# Altium schematic sheet 51control.SchDoc
size A4
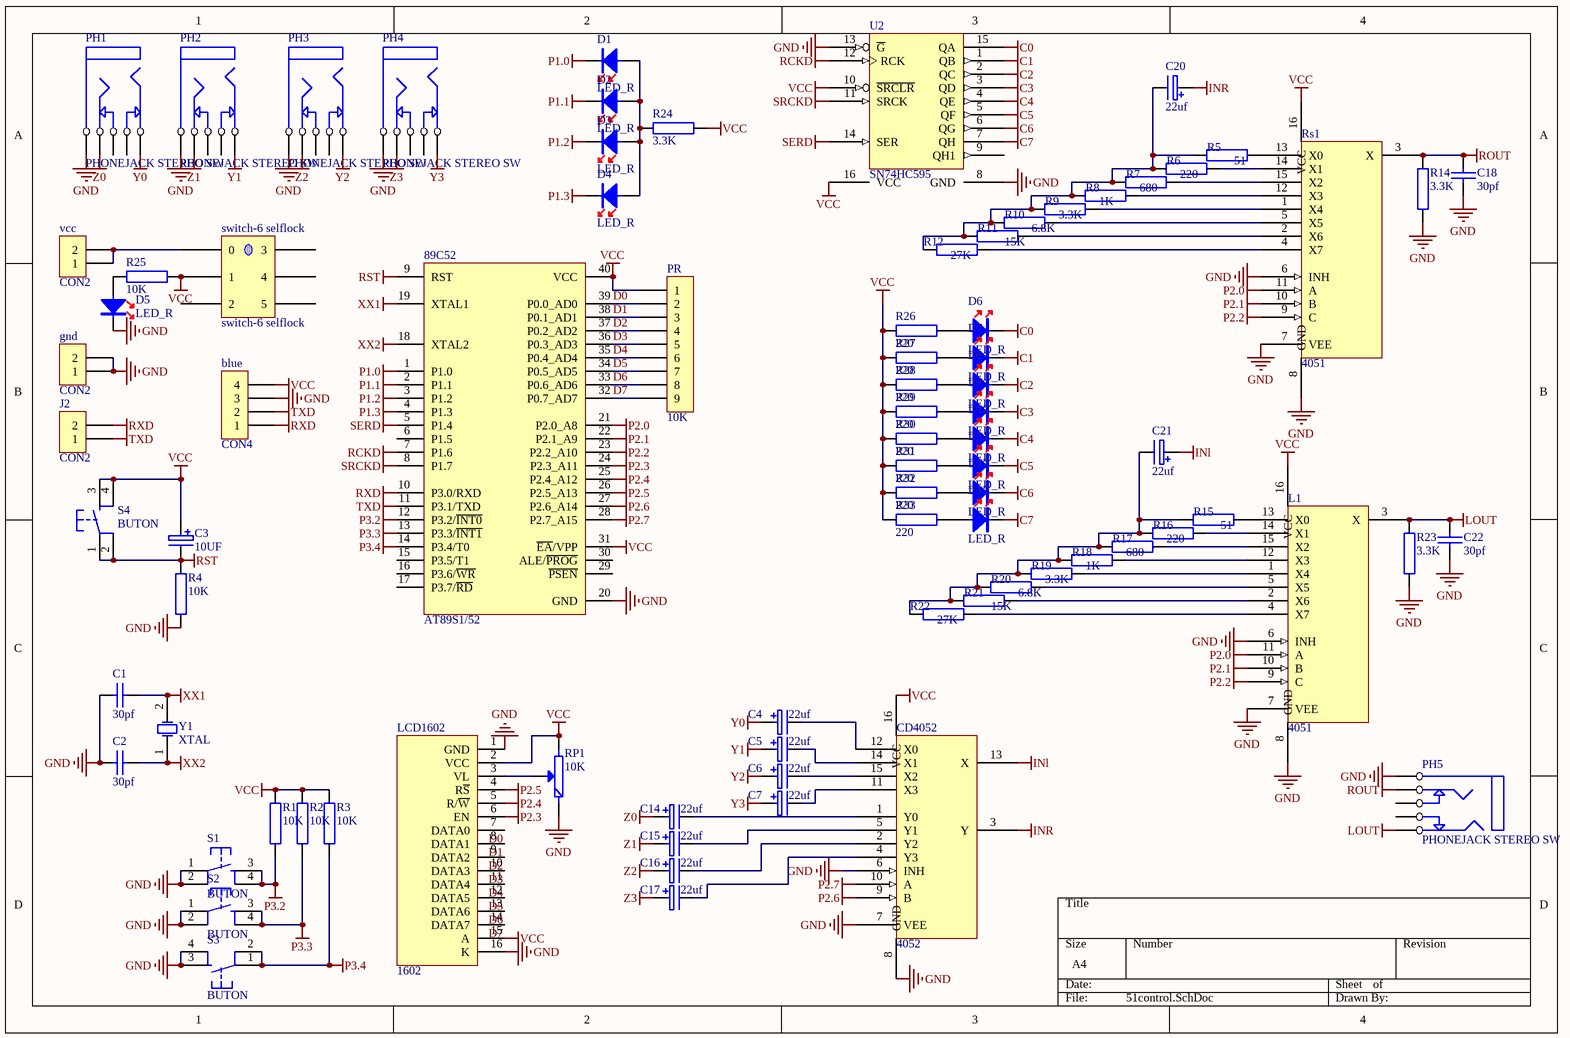
[diagram p0: 51control.SchDoc]

## Parts
89C52  AT89S1/52  [DIP40]
blue  CON4  [sip-4]
C1  30pf  [0603]
C2  30pf  [0603]
C3  10UF  [CAO2]
C4  22uf  [CAO2]
C5  22uf  [CAO2]
C6  22uf  [CAO2]
C7  22uf  [CAO2]
C14  22uf  [CAO2]
C15  22uf  [CAO2]
C16  22uf  [CAO2]
C17  22uf  [CAO2]
C18  30pf  [0603]
C20  22uf  [CAO2]
C21  22uf  [CAO2]
C22  30pf  [0603]
CD4052  4052  [CD4052]
D1  LED_R  [LED2_R]
D2  LED_R  [LED2_R]
D3  LED_R  [LED2_R]
D4  LED_R  [LED2_R]
D5  LED_R  [LED_0805]
D6  LED_R  [LED_0805]
D7  LED_R  [LED_0805]
D8  LED_R  [LED_0805]
D9  LED_R  [LED_0805]
D10  LED_R  [LED_0805]
D11  LED_R  [LED_0805]
D12  LED_R  [LED_0805]
D13  LED_R  [LED_0805]
gnd  CON2  [2P-200]
J2  CON2  [sip-2]
L1  4051  [CD4051 NSG]
LCD1602  1602  [1602A]
PH1  PHONEJACK STEREO SW  [SOUND1]
PH2  PHONEJACK STEREO SW  [SOUND1]
PH3  PHONEJACK STEREO SW  [SOUND1]
PH4  PHONEJACK STEREO SW  [SOUND1]
PH5  PHONEJACK STEREO SW  [SOUND1]
PR  10K  [sip-9]
R1  10K  [0603]
R2  10K  [0603]
R3  10K  [0603]
R4  10K  [0603]
R5  51  [0805]
R6  220  [0805]
R7  680  [0805]
R8  1K  [0805]
R9  3.3K  [0805]
R10  6.8K  [0805]
R11  15K  [0805]
R12  27K  [0805]
R14  3.3K  [0805]
R15  51  [0805]
R16  220  [0805]
R17  680  [0805]
R18  1K  [0805]
R19  3.3K  [0805]
R20  6.8K  [0805]
R21  15K  [0805]
R22  27K  [0805]
R23  3.3K  [0805]
R24  3.3K  [0805]
R25  10K  [0603]
R26  220  [0805]
R27  220  [0805]
R28  220  [0805]
R29  220  [0805]
R30  220  [0805]
R31  220  [0805]
R32  220  [0805]
R33  220  [0805]
RP1  10K  [RVR-2]
Rs1  4051  [CD4051 NSG]
S1  BUTON  [TACTILE-PTH]
S2  BUTON  [TACTILE-PTH]
S3  BUTON  [TACTILE-PTH]
S4  BUTON  [TACTILE-PTH]
switch-6_selflock  switch-6 selflock  [switch-6 lockself]
U2  SN74HC595  [SO16]
vcc  CON2  [2P-200]
Y1  XTAL  [XTAL-RAD-0.2]

## Nets
C0: D6.2 U2.15(QA)
C1: D7.2 U2.1(QB)
C2: D8.2 U2.2(QC)
C3: D9.2 U2.3(QD)
C4: D10.2 U2.4(QE)
C5: D11.2 U2.5(QF)
C6: D12.2 U2.6(QG)
C7: D13.2 U2.7(QH)
GND: 89C52.20(GND) blue.3 C1.2 C2.2 C18.2 C22.2 CD4052.6(INH) CD4052.7(VEE) CD4052.8(GND) D5.2 gnd.1 gnd.2 L1.6(INH) L1.7(VEE) L1.8(GND) LCD1602.1(GND) LCD1602.16(K) PH1.5(E) PH2.5(E) PH3.5(E) PH4.5(E) PH5.5(E) R4.2 R14.1 R23.1 RP1.1 Rs1.6(INH) Rs1.7(VEE) Rs1.8(GND) S1.1 S1.2 S2.1 S2.2 S3.3 S3.4 U2.8(GND) U2.13(~{G})
INl: C21.1 CD4052.13(X)
INR: C20.1 CD4052.3(Y)
LOUT: C22.1 L1.3(X) PH5.1(A) R23.2
P1.0: 89C52.1(P1.0) D1.2
P1.1: 89C52.2(P1.1) D2.2
P1.2: 89C52.3(P1.2) D3.2
P1.3: 89C52.4(P1.3) D4.2
P2.0: 89C52.21(P2.0_A8) L1.11(A) Rs1.11(A)
P2.1: 89C52.22(P2.1_A9) L1.10(B) Rs1.10(B)
P2.2: 89C52.23(P2.2_A10) L1.9(C) Rs1.9(C)
P2.3: 89C52.24(P2.3_A11) LCD1602.6(EN)
P2.4: 89C52.25(P2.4_A12) LCD1602.5(R/~{W})
P2.5: 89C52.26(P2.5_A13) LCD1602.4(R~{S})
P2.6: 89C52.27(P2.6_A14) CD4052.9(B)
P2.7: 89C52.28(P2.7_A15) CD4052.10(A)
P3.2: 89C52.12(P3.2/~{INT0}) R1.1 S1.3 S1.4
P3.3: 89C52.13(P3.3/~{INT1}) R2.1 S2.3 S2.4
P3.4: 89C52.14(P3.4/T0) R3.1 S3.1 S3.2
RCKD: 89C52.7(P1.6) U2.12(RCK)
ROUT: C18.1 PH5.4(D) R14.2 Rs1.3(X)
RST: 89C52.9(RST) C3.2 R4.1 S4.1 S4.2
RXD: 89C52.10(P3.0/RXD) blue.1 J2.2
SERD: 89C52.5(P1.4) U2.14(SER)
SRCKD: 89C52.8(P1.7) U2.11(SRCK)
TXD: 89C52.11(P3.1/TXD) blue.2 J2.1
VCC: 89C52.31(~{EA}/VPP) 89C52.40(VCC) blue.4 C3.1 CD4052.16(VCC) L1.16(VCC) LCD1602.2(VCC) LCD1602.15(A) PR.1 R1.2 R2.2 R3.2 R24.1 R25.2 R26.2 R27.2 R28.2 R29.2 R30.2 R31.2 R32.2 R33.2 RP1.3 Rs1.16(VCC) S4.3 S4.4 switch-6_selflock.1 U2.10(~{SRCLR}) U2.16(VCC)
XX1: 89C52.19(XTAL1) C1.1 Y1.2(OSC2)
XX2: 89C52.18(XTAL2) C2.1 Y1.1(OSC1)
Y0: C4.1 PH1.1(A)
Y1: C5.1 PH2.1(A)
Y2: C6.1 PH3.1(A)
Y3: C7.1 PH4.1(A)
Z0: C14.1 PH1.4(D)
Z1: C15.1 PH2.4(D)
Z2: C16.1 PH3.4(D)
Z3: C17.1 PH4.4(D)
D0: 89C52.39(P0.0_AD0) LCD1602.7(DATA0) PR.2
D1: 89C52.38(P0.1_AD1) LCD1602.8(DATA1) PR.3
D2: 89C52.37(P0.2_AD2) LCD1602.9(DATA2) PR.4
D3: 89C52.36(P0.3_AD3) LCD1602.10(DATA3) PR.5
D4: 89C52.35(P0.4_AD4) LCD1602.11(DATA4) PR.6
D5: 89C52.34(P0.5_AD5) LCD1602.12(DATA5) PR.7
D6: 89C52.33(P0.6_AD6) LCD1602.13(DATA6) PR.8
D7: 89C52.32(P0.7_AD7) LCD1602.14(DATA7) PR.9
NetC4_2: C4.2 CD4052.12(X0)
NetC5_2: C5.2 CD4052.14(X1)
NetC6_2: C6.2 CD4052.15(X2)
NetC7_2: C7.2 CD4052.11(X3)
NetC14_2: C14.2 CD4052.1(Y0)
NetC15_2: C15.2 CD4052.5(Y1)
NetC16_2: C16.2 CD4052.2(Y2)
NetC17_2: C17.2 CD4052.4(Y3)
NetC20_2: C20.2 R5.1 R6.1 R7.1 R8.1 R9.1 R10.1 R11.1 R12.1
NetC21_2: C21.2 R15.1 R16.1 R17.1 R18.1 R19.1 R20.1 R21.1 R22.1
NetD1_1: D1.1 D2.1 D3.1 D4.1 R24.2
NetD5_1: D5.1 R25.1
NetD6_1: D6.1 R26.1
NetD7_1: D7.1 R27.1
NetD8_1: D8.1 R28.1
NetD9_1: D9.1 R29.1
NetD10_1: D10.1 R30.1
NetD11_1: D11.1 R31.1
NetD12_1: D12.1 R32.1
NetD13_1: D13.1 R33.1
NetL1_1: L1.1(X4) R19.2
NetL1_2: L1.2(X6) R21.2
NetL1_4: L1.4(X7) R22.2
NetL1_5: L1.5(X5) R20.2
NetL1_12: L1.12(X3) R18.2
NetL1_13: L1.13(X0) R15.2
NetL1_14: L1.14(X1) R16.2
NetL1_15: L1.15(X2) R17.2
NetLCD1602_3: LCD1602.3(VL) RP1.2(M)
NetR5_2: R5.2 Rs1.13(X0)
NetR6_2: R6.2 Rs1.14(X1)
NetR7_2: R7.2 Rs1.15(X2)
NetR8_2: R8.2 Rs1.12(X3)
NetR9_2: R9.2 Rs1.1(X4)
NetR10_2: R10.2 Rs1.5(X5)
NetR11_2: R11.2 Rs1.2(X6)
NetR12_2: R12.2 Rs1.4(X7)
Netswitch-6_selflock_0: switch-6_selflock.0 vcc.1 vcc.2

Not connected (* = marked no-connect by the designer): 89C52 6(P1.5) 15(P3.5/T1) 16(P3.6/~{WR}) 17(P3.7/~{RD}) 29(~{PSEN}) 30(ALE/~{PROG}); PH1 2(B) 3(C); PH2 2(B) 3(C); PH3 2(B) 3(C); PH4 2(B) 3(C); PH5 2(B) 3(C); switch-6_selflock 2 3 4 5; U2 9(QH1)

## Library data of the parts
89C52 = AT89S1/52: 8051/52单片机
blue = CON4: Connector
C1 C2 C18 C22 = CAP1
C3-C7 C14-C17 C20 C21 = CAP3
gnd J2 vcc = CON2: Connector
PR = CON9: Connector
R1-R12 R14-R33 = RES: 电阻
RP1 = RPOT-1: 普通电位器
switch-6_selflock = Component_1
U2 = SN74HC595: 8-BIT SFT REG WIRTH OUTPUT LCH
Y1 = XTAL: 晶体振荡器; Published: 8-Jun-2000; LatestRevisionDate: 17-Jul-2002; LatestRevisionNote: Re-released for DXP Platform.; PackageReference: R38; Publisher: Altium Limited